# Altium project PWM.PrjPcb
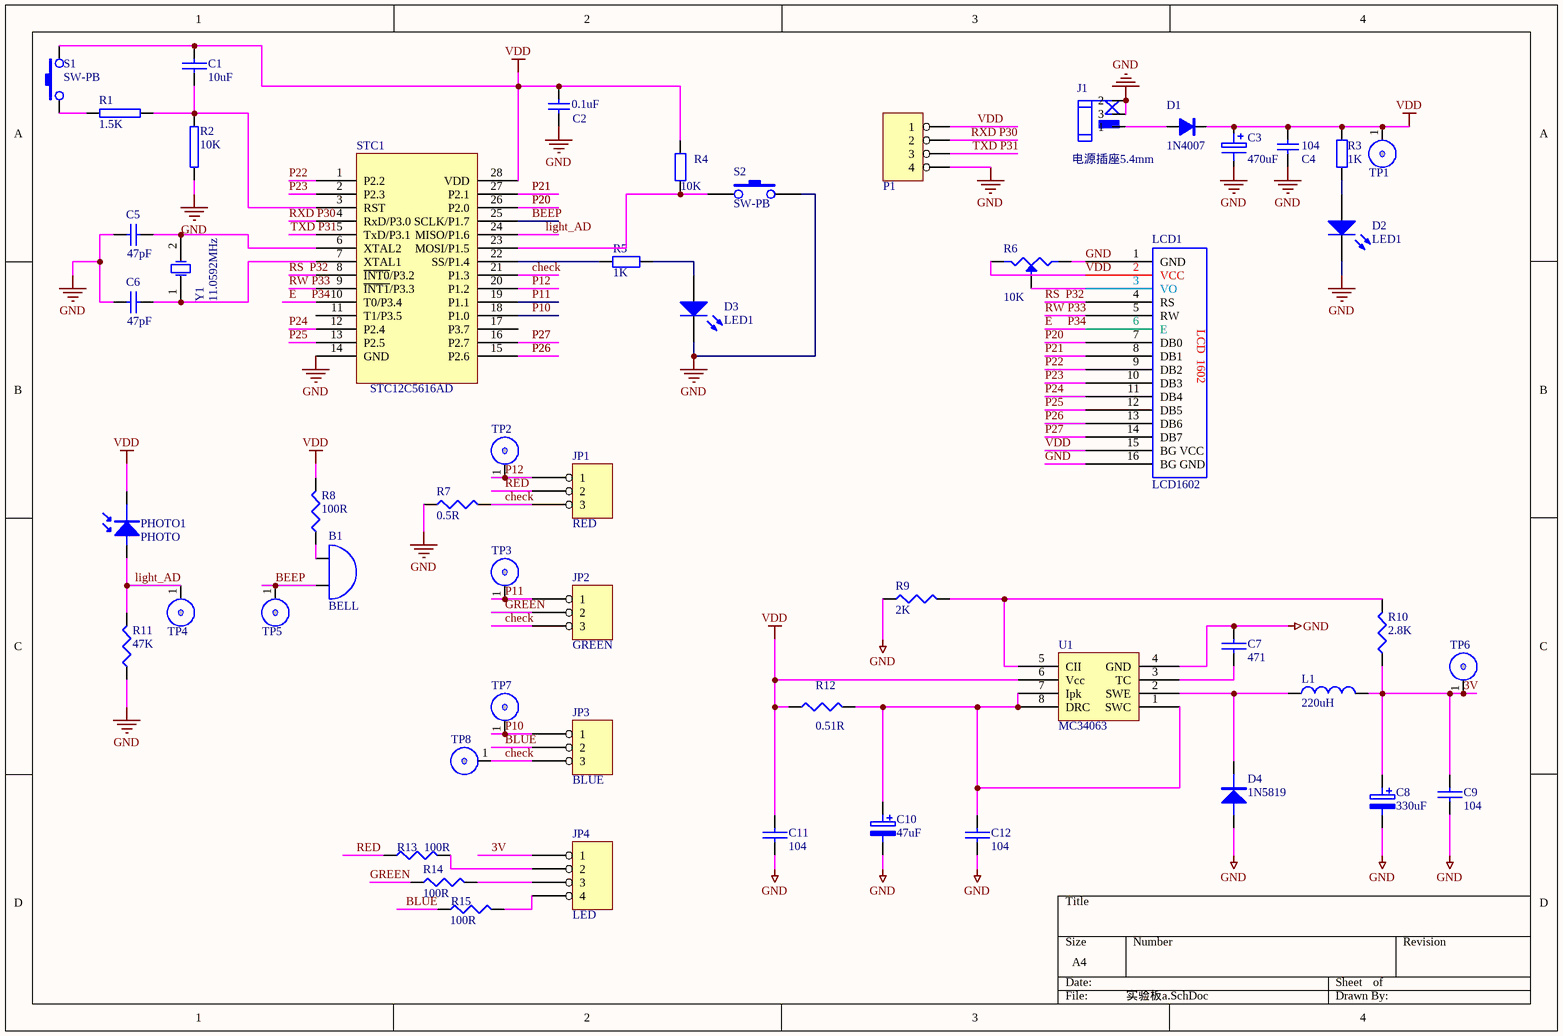
[diagram p0: 实验板a.SchDoc]
1 sheet, 54 parts. Net scope: global (net labels, ports and power ports of the same name join across sheets).
Board file: PWM_change.PcbDoc

## Sheet 实验板a.SchDoc
size A4

### Parts
B1  BELL  [BELL]
C1  10uF  [C1]
C2  0.1uF  [C1]
C3  470uF  [RB.15/.3]
C4  value 104  [C1]  (hidden comment: 104u)
C5  47pF  [C1]
C6  47pF  [C1]
C7  471  [C1]
C8  330uF  [RB.15/.3]
C9  104  [C1]
C10  47uF  [RB.15/.3]
C11  104  [C1]
C12  104  [C1]
D1  1N4007  [DIODE0.4]
D2  LED1  [LED--5]
D3  LED1  [LED--5]
D4  1N5819  [DIODE0.4]
J1  电源插座5.4mm  [DC-005]
JP1  RED  [SIP3]
JP2  GREEN  [SIP3]
JP3  BLUE  [SIP3]
JP4  LED  [SIP4]
L1  220uH  [L-4*15]
LCD1  LCD1602  [lcd1602]
P1  HEADER 4  [SIP4]  (value not drawn)
PHOTO1  PHOTO  [C2]
R1  1.5K  [AXIAL0.4]
R2  10K  [AXIAL0.4]
R3  1K  [AXIAL0.4]
R4  10K  [AXIAL0.4]
R5  1K  [AXIAL0.4]
R6  10K  [VR5]
R7  0.5R  [AXIAL0.4]
R8  100R  [AXIAL0.4]
R9  2K  [AXIAL0.4]
R10  2.8K  [AXIAL0.4]
R11  47K  [AXIAL0.4]
R12  0.51R  [AXIAL0.4]
R13  100R  [AXIAL0.4]
R14  100R  [AXIAL0.4]
R15  100R  [AXIAL0.4]
S1  SW-PB  [SWPB1]
S2  SW-PB  [SWPB1]
STC1  STC12C5616AD  [DIP28S]
TP1  TP-1  [TP-1-1]  (value not drawn)
TP2  TP-1  [TP-1-1]  (value not drawn)
TP3  TP-1  [TP-1-1]  (value not drawn)
TP4  TP-1  [TP-1-1]  (value not drawn)
TP5  TP-1  [TP-1-1]  (value not drawn)
TP6  TP-1  [TP-1-1]  (value not drawn)
TP7  TP-1  [TP-1-1]  (value not drawn)
TP8  TP-1  [TP-1-1]  (value not drawn)
U1  MC34063  [DIP8]
Y1  11.0592MHz  [CY2]

### Nets
GND: C2.1 C3.2 C4.1 C5.2 C6.2 C7.1 C8.2 C9.2 C10.2 C11.2 C12.2 D2.2(K) D3.2(K) D4.A J1.2 J1.3 LCD1.1(GND) LCD1.16(BG_GND) P1.4 R2.2 R6.1 R7.1 R9.1 R11.1 S2.2 STC1.14(GND) U1.4(GND)
VDD: C1.1 C2.2 C3.1 C4.2 C11.1 D1.2 LCD1.2(VCC) LCD1.15(BG_VCC) P1.1 PHOTO1.K R3.2 R4.2 R6.2 R8.2 R12.1 S1.2 STC1.28(VDD) TP1.1 U1.6(Vcc)
3V: C8.1 C9.1 JP4.1 L1.2 R10.1 TP6.1
BEEP: B1.2 STC1.25(SCLK/P1.7) TP5.1
BLUE: JP3.2 R15.1
check: JP1.3 JP2.3 JP3.3 R7.2 STC1.21(P1.3) TP8.1
E     P34: LCD1.6(E) STC1.10(T0/P3.4)
GREEN: JP2.2 R14.1
light_AD: PHOTO1.A R11.2 STC1.24(MISO/P1.6) TP4.1
P10: JP3.1 STC1.18(P1.0) TP7.1
P11: JP2.1 STC1.19(P1.1) TP3.1
P12: JP1.1 STC1.20(P1.2) TP2.1
P20: LCD1.7(DB0) STC1.26(P2.0)
P21: LCD1.8(DB1) STC1.27(P2.1)
P22: LCD1.9(DB2) STC1.1(P2.2)
P23: LCD1.10(DB3) STC1.2(P2.3)
P24: LCD1.11(DB4) STC1.12(P2.4)
P25: LCD1.12(DB5) STC1.13(P2.5)
P26: LCD1.13(DB6) STC1.15(P2.6)
P27: LCD1.14(DB7) STC1.16(P2.7)
RED: JP1.2 R13.1
RS  P32: LCD1.4(RS) STC1.8(~{INT0}/P3.2)
RW P33: LCD1.5(RW) STC1.9(~{INT1}/P3.3)
RXD P30: P1.2 STC1.4(RxD/P3.0)
TXD P31: P1.3 STC1.5(TxD/P3.1)
NetB1_1: B1.1 R8.1
NetC1_2: C1.2 R1.2 R2.1 STC1.3(RST)
NetC5_1: C5.1 STC1.6(XTAL2) Y1.2(OSC2)
NetC6_1: C6.1 STC1.7(XTAL1) Y1.1(OSC1)
NetC7_2: C7.2 U1.3(TC)
NetC10_1: C10.1 C12.1 R12.2 U1.1(SWC) U1.7(Ipk) U1.8(DRC)
NetD1_1: D1.1 J1.1
NetD2_1: D2.1(A) R3.1
NetD3_1: D3.1(A) R5.1
NetD4_K: D4.K L1.1 U1.2(SWE)
NetJP4_2: JP4.2 R13.2
NetJP4_3: JP4.3 R14.2
NetJP4_4: JP4.4 R15.2
NetLCD1_3: LCD1.3(VO) R6.W
NetR1_1: R1.1 S1.1
NetR4_1: R4.1 S2.1 STC1.23(MOSI/P1.5)
NetR5_2: R5.2 STC1.22(SS/P1.4)
NetR9_2: R9.2 R10.2 U1.5(CII)

Not connected (* = marked no-connect by the designer): STC1 11(T1/P3.5) 17(P3.7)

### Notes on the sheet
- (in symbol LCD1602) LCD  1602

### Library data of the parts
C1 C7 C9 C11 C12 = CAP
C2 = Cap: Capacitor; Value: 0.1u; Published: 8-Jun-2000; LatestRevisionDate: 17-Jul-2002; LatestRevisionNote: Re-released for DXP Platform.; PackageReference: RAD-0.3; Publisher: Altium Limited
C3 = CD: 电解电容
C4 = Cap: Capacitor; Published: 8-Jun-2000; LatestRevisionDate: 17-Jul-2002; LatestRevisionNote: Re-released for DXP Platform.; PackageReference: RAD-0.3; Publisher: Altium Limited
C5 C6 = Cap: Capacitor; Value: 30p; Published: 8-Jun-2000; LatestRevisionDate: 17-Jul-2002; LatestRevisionNote: Re-released for DXP Platform.; PackageReference: RAD-0.3; Publisher: Altium Limited
C8 C10 = ELECTRO2
D1 = D1: pin to pad: 1>A 2>K
D2 D3 = LED1: Typical RED GaAs LED; pin to pad: 1>A 2>K; Published: 8-Jun-2000; LatestRevisionDate: 08-Jul-2005; LatestRevisionNote: Mech Layer 1 removed.; PackageReference: LED-1; Publisher: Altium Limited
D4 = DIODE
JP1-JP3 = HEADER 3
JP4 = HEADER 4
L1 = INDUCTOR
P1 = HEADER 4: 4 Pin Header
PHOTO1 = PHOTO: pin to pad: A>1 K>2
R1 R2 = RES2
R3 R5 = Res2: Resistor; Value: 10K; Published: 8-Jun-2000; LatestRevisionDate: 17-Jul-2002; LatestRevisionNote: Re-released for DXP Platform.; PackageReference: AXIAL-0.4; Publisher: Altium Limited
R4 = Res2: Resistor; Value: 1K; Published: 8-Jun-2000; LatestRevisionDate: 17-Jul-2002; LatestRevisionNote: Re-released for DXP Platform.; PackageReference: AXIAL-0.4; Publisher: Altium Limited
R6 = POT1
R7-R15 = RES1
STC1 = STC12C5410-35C-PSOP28
Y1 = XTAL: Crystal Oscillator; Published: 8-Jun-2000; LatestRevisionDate: 17-Jul-2002; LatestRevisionNote: Re-released for DXP Platform.; PackageReference: R38; Publisher: Altium Limited